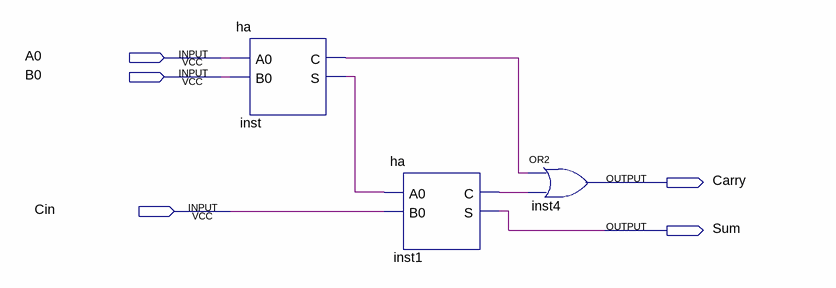
[diagram p0: schematic sheet]
// Quartus schematic fulladder.bdf as structural Verilog: 3 symbols, 5 pins
module fulladder (
  input  A0,
  input  B0,
  input  Cin,
  output Carry,
  output Sum
);

  wire inst1_c, inst_c, inst_s;

  ha inst (.A0(A0), .B0(B0), .C(inst_c), .S(inst_s));
  ha inst1 (.A0(inst_s), .B0(Cin), .C(inst1_c), .S(Sum));
  or inst4 (Carry, inst_c, inst1_c);
endmodule
